# Altium schematic sheet P1.schdoc
size 297 x 209 mm; Symbol: Drawing-Symbol_A4; @Project Name: New Project_2026-06-10_22-28-21; @Page Count: 1; @Update Date: 2026-06-10; @Create Date: 2026-06-10; @Schematic Name: Schematic1; @Page No: 1; @Page Name: P1; Company: EasyEDA.com; Version: V1.0; Page Size: A4; Device: Drawing-Symbol_A4; @Create Time: 22:28:39; @Update Time: 22:28:39; Border: 1; Width: 1170; Height: 825; Region Start: 1; X Region Count: 6; Y Region Count: 4; Blade Width: 10; Title Block Position: 3; @Board Name: Board1
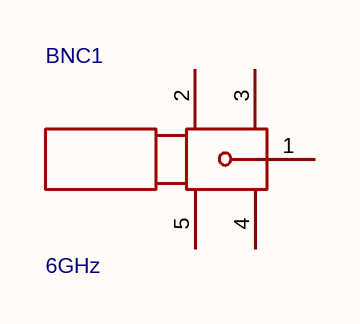
[diagram p0: P1.schdoc]

## Parts
BNC1  6GHz  [CONN-TH_BNC-KWE-6]

## Nets

Not connected (* = marked no-connect by the designer): BNC1 1 2 3 4 5

## Notes on the sheet
- Create at
- 2026-06-10
- Schematic
- Board
- Schematic1
- Board1
- Update at
- Page
- P1
- Drawn
- Reviewed
- New Project_2026-06-10_22-28-21
- Version
- V1.0
- Size
- A4
- Page  1  Total  1
- EasyEDA.com

## Library data of the parts
BNC1 = BNC-KWE-6: Connector Type:Board Side Interface:Inner Bore Number of Ports:1 Interface Length/Height:12mm Frequency:6GHz RF Series:BNC Impedance:50Ω Style:Bent tip; Manufacturer: cntitle(中戈泰斗); AddInBom: yes; ModelId: 1ee7285c1b8f4c589de2df097266f0050819f05c4eef4c71ace90d822a990e87; ModelTransform: 531.016,1338.97378,0,0,0,0,0,-470.511,-149.606; Number of Ports: 1; Interface Length/Height: 12mm; RF Series: BNC; Impedance: 50Ω; Symbol: BNC-KWE-6; Device: BNC-KWE-6; LCSC Part Name: 内孔 BNC 弯头; SupplierPart: C20415789; ManufacturerPart: BNC-KWE-6; Supplier Footprint: 弯插; JLCPCB Part Class: Extended Part; Datasheet: https://item.szlcsc.com/datasheet/BNC-KWE-6/21743971.html; Supplier: LCSC; ConvertToPcb: yes; FootprintName: CONN-TH_BNC-KWE-6; ModelName: CONN-TH_BNC-KWE-6; Connector Type: Board Side; Interface: Inner Bore; Value: 6GHz; Style: Bent tip